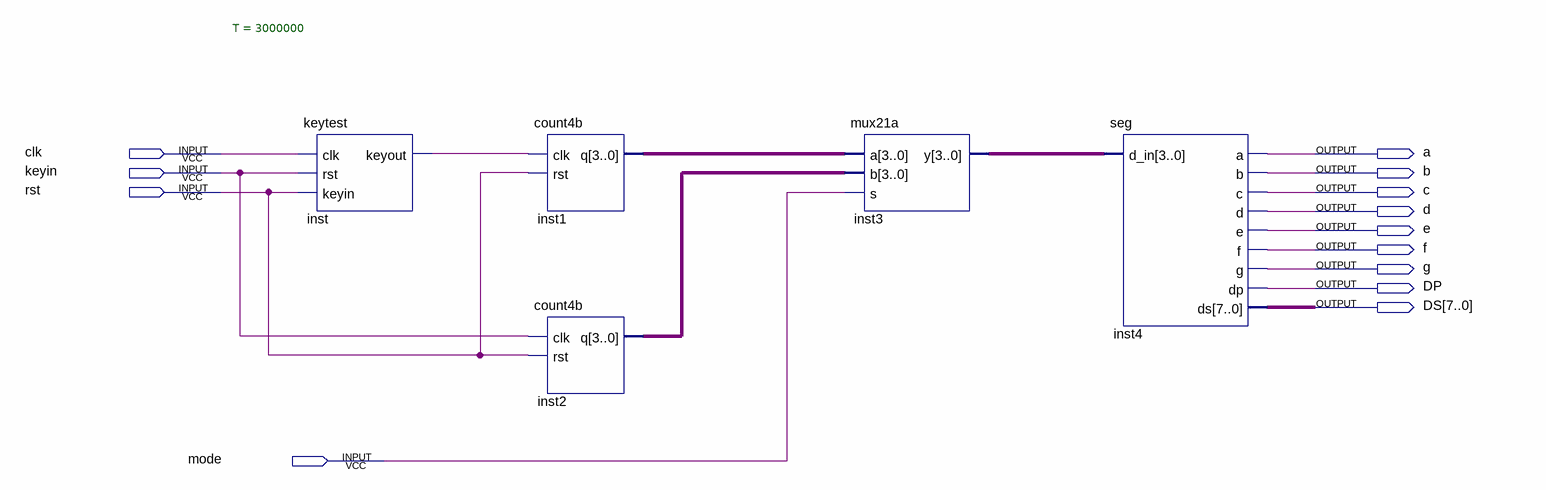
[diagram p0: schematic sheet]
// Quartus schematic debounce.bdf as structural Verilog: 5 symbols, 13 pins
module debounce (
  input  clk,
  input  keyin,
  input  rst,
  input  mode,
  output a,
  output b,
  output c,
  output d,
  output e,
  output f,
  output g,
  output DP,
  output [7:0] DS
);

  wire inst_keyout;
  wire [3:0] inst1_q, inst2_q, inst3_y;

  keytest #(.T(3000000)) inst (.clk(clk), .rst(keyin), .keyin(rst), .keyout(inst_keyout));
  count4b inst1 (.clk(inst_keyout), .rst(rst), .q(inst1_q));
  count4b inst2 (.clk(keyin), .rst(rst), .q(inst2_q));
  mux21a inst3 (.a(inst1_q), .b(inst2_q), .s(mode), .y(inst3_y));
  seg inst4 (.d_in(inst3_y), .a(a), .b(b), .c(c), .d(d), .e(e), .f(f), .g(g), .dp(DP), .ds(DS));
endmodule
